# EAGLE design XBee-Regulated-v12 (EAGLE 5.04)
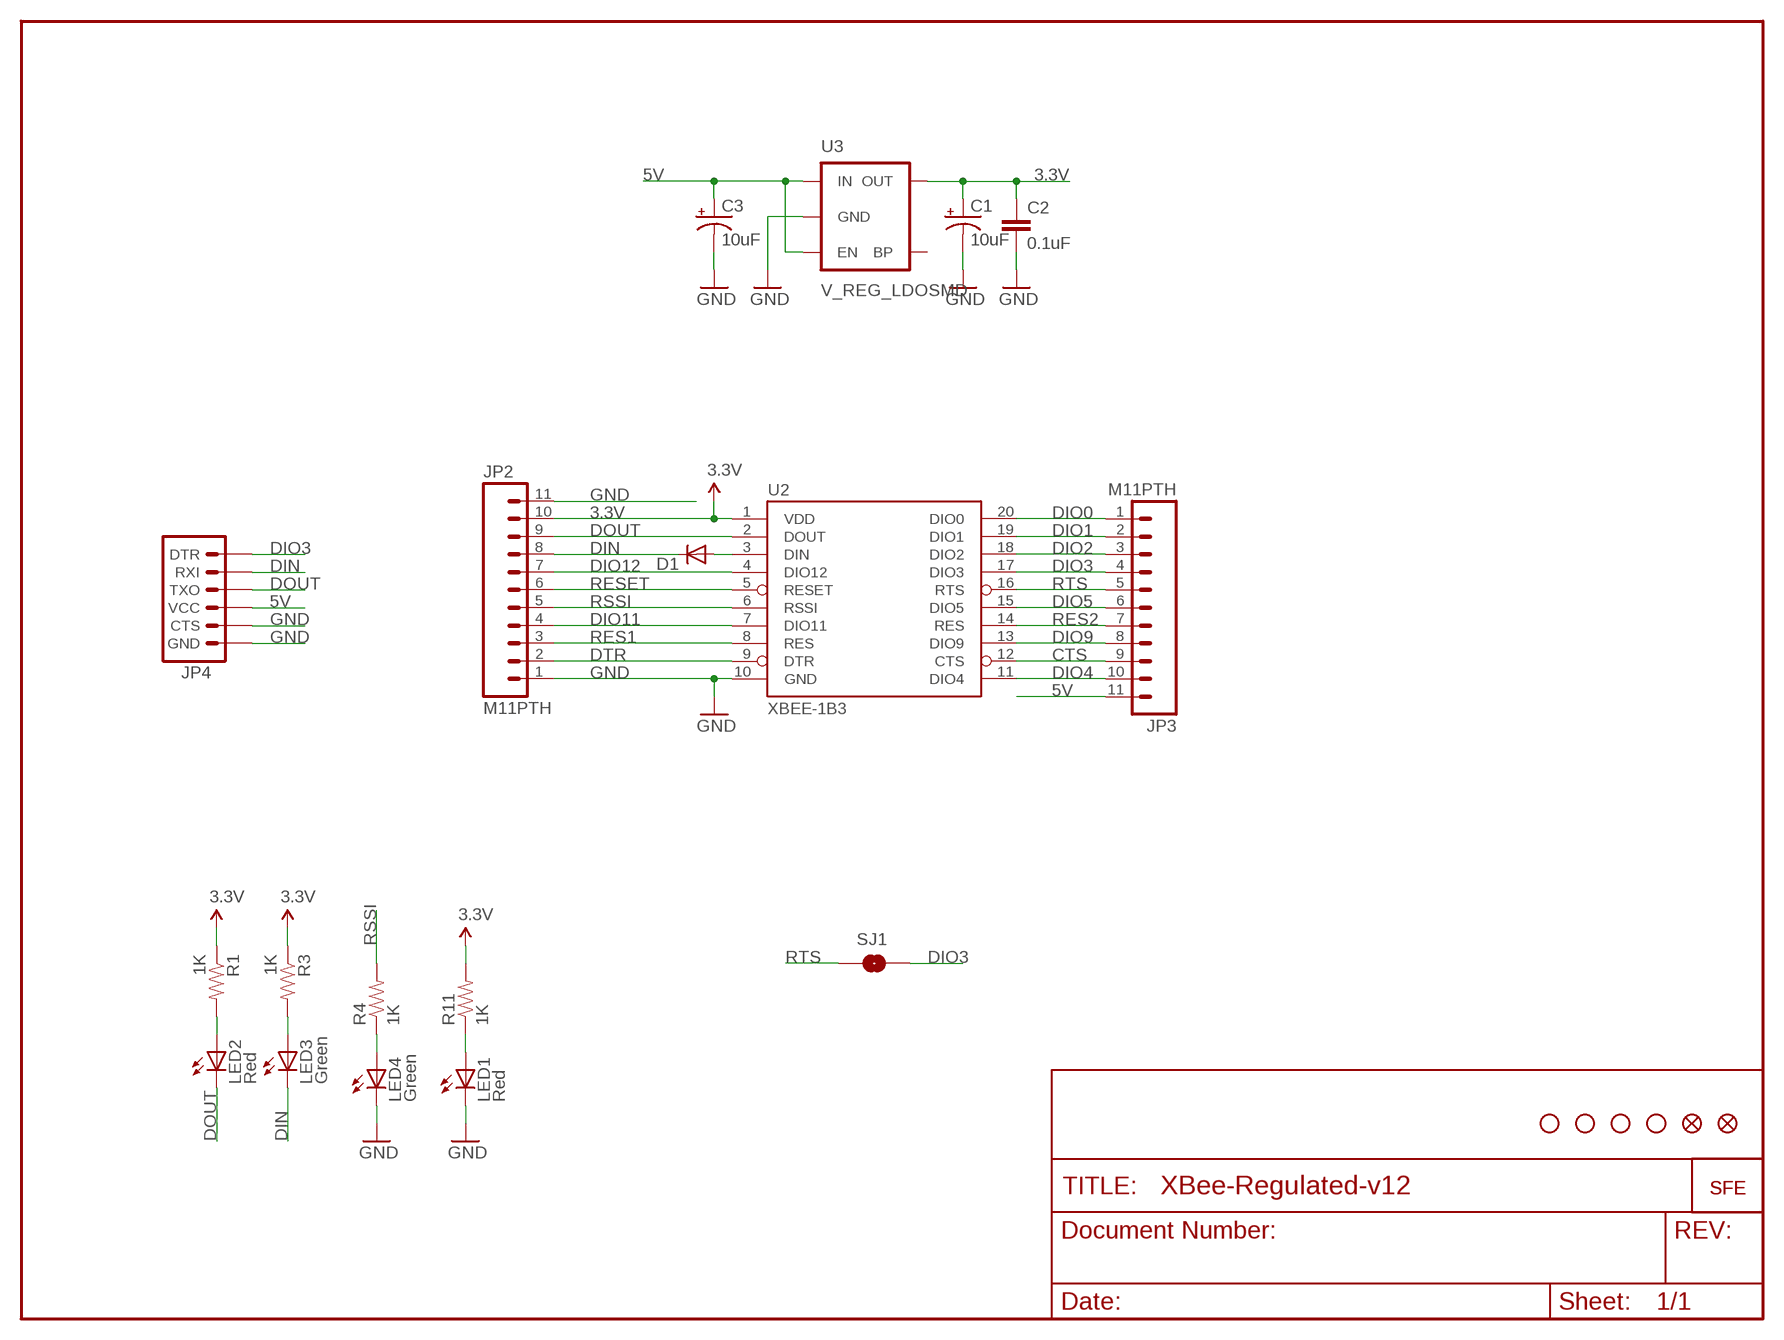
[diagram p0: schematic, sheet 1]

## Parts
C1  10uF  CAP_POL1206  [EIA3216]
C2  0.1uF  CAP0402-CAP  [0402-CAP]
C3  10uF  CAP_POL1206  [EIA3216]
D1  DIODESOD  [SOD-323]
JP2  M11PTH  [1X11]
JP3  M11PTH  [1X11]
JP4  ARDUINO_SERIAL_PROGRAMPTH  [1X06]
LED1  Red  LED0603  [LED-0603]
LED2  Red  LED0603  [LED-0603]
LED3  Green  LED0603  [LED-0603]
LED4  Green  LED0603  [LED-0603]
R1  1K  RESISTOR0402-RES  [0402-RES]
R3  1K  RESISTOR0402-RES  [0402-RES]
R4  1K  RESISTOR0402-RES  [0402-RES]
R11  1K  RESISTOR0402-RES  [0402-RES]
SJ1  SOLDERJUMPERNO  [SJ_2S-NO]
U2  XBEE-1B3  [XBEE-SMD]
U3  V_REG_LDOSMD  [SOT23-5]
U$1  LOGO-SFESK  [SFE-LOGO-FLAME]
U$4  LOGO-SFENEW  [SFE-NEW-WEBLOGO]
U$5  STAND-OFF  [STAND-OFF]
U$7  FIDUCIAL1X2  [FIDUCIAL-1X2]
U$9  STAND-OFF  [STAND-OFF]
U$10  STAND-OFF  [STAND-OFF]
U$11  STAND-OFF  [STAND-OFF]
U$16  FIDUCIAL1X2  [FIDUCIAL-1X2]

## Nets
3.3V [vcc]: C1.A(+) C2.1 JP2.10 R1.1 R3.1 R11.2 U2.1(VDD) U3.5(OUT)
5V [vcc]: C3.A(+) JP3.11 JP4.4(VCC) U3.1(IN) U3.3(EN)
CTS: JP3.9 U2.12(CTS)
DIN: D1.1(C) JP2.8 JP4.2(RXI) LED3.C
DIO0: JP3.1 U2.20(DIO0)
DIO1: JP3.2 U2.19(DIO1)
DIO2: JP3.3 U2.18(DIO2)
DIO3: JP3.4 JP4.1(DTR) SJ1.2 U2.17(DIO3)
DIO4: JP3.10 U2.11(DIO4)
DIO5: JP3.6 U2.15(DIO5)
DIO9: JP3.8 U2.13(DIO9)
DIO11: JP2.4 U2.7(DIO11)
DIO12: JP2.7 U2.4(DIO12)
DOUT: JP2.9 JP4.3(TXO) LED2.C U2.2(DOUT)
DTR: JP2.2 U2.9(DTR)
GND [vcc]: C1.C(-) C2.2 C3.C(-) JP2.1 JP2.11 JP4.5(CTS) JP4.6(GND) LED1.C LED4.C U2.10(GND) U3.2(GND)
N$1: LED2.A R1.2
N$2: LED4.A R4.1
N$3: D1.2(A) U2.3(DIN)
N$4: LED3.A R3.2
N$38: LED1.A R11.1
RES1: JP2.3 U2.8(RES)
RES2: JP3.7 U2.14(RES)
RESET: JP2.6 U2.5(RESET)
RSSI: JP2.5 R4.2 U2.6(RSSI)
RTS: JP3.5 SJ1.1 U2.16(RTS)
Unconnected: U3.4(BP)

## Library data of the parts
C1 C3 = SparkFun:CAP_POL: Capacitor Polarized These are standard SMD and PTH capacitors. Normally 10uF, 47uF, and 100uF in electrolytic and tantalum varieties. Always verify the external diameter of the through hole cap, it varies with capacity, voltage, and manufacturer. The EIA devices should be standard.
C2 = SparkFun:CAP: Capacitor Standard 0603 ceramic capacitor, and 0.1" leaded capacitor.
D1 = SparkFun:DIODE: Diode These are standard reverse protection diodes and small signal diodes. SMA package can handle up to about 1A. SOD-323 can handle about 200mA. What the SOD-323 package when ordering, there are some mfgs out there that are 5-pin packages.
JP2 JP3 = SparkFun:M11: Header 11 Standard 11-pin 0.1" header. Use with straight break away headers (SKU : PRT-00116), right angle break away headers (PRT-00553), swiss pins (PRT-00743), machine pins (PRT-00117), and female headers (PRT-00115).
JP4 = SparkFun:ARDUINO_SERIAL_PROGRAM
LED1-LED4 = SparkFun:LED: LEDs Standard schematic elements and footprints for 5mm, 3mm, 1206, and 0603 sized LEDs. 5mm - Spark Fun Electronics SKU : COM-00529 (and others)
R1 R3 R4 R11 = SparkFun:RESISTOR: Resistor Basic schematic elements and footprints for 0603, 1206, and PTH 1/10th watt (small) resistors.
SJ1 = SparkFun:SOLDERJUMPER: Solder Jumper Standard SMD solder jumper. Used to automate production. Two varients : Normally Open and Normally Closed are the same, but have different paste layers. NC will have a large amount of paste and should jumper during reflow.
U2 = SparkFun:XBEE-1
U3 = SparkFun:V_REG_LDO: Voltage Regulator LDO Standard 150mA LDO voltage regulator in SOT-23 layout. Micrel part MIC5205. BP (by-pass) pin is used to lower output noise with 470pF cap.
U$1 U$4 = SparkFun:LOGO-SFE: Spark Fun Electronics PCB Logo This is the standard Spark Fun Electronics PCB logo.
U$5 U$9-U$11 = SparkFun:STAND-OFF: Stand Off This is the mechanical footprint for a #4 phillips button head screw. Use the keepout ring to avoid running the screw head into surrounding components. SKU : PRT-00447
U$7 U$16 = SparkFun:FIDUCIAL: Fiducial Alignment Points Various fiducial points for machine vision alignment.

## Net classes
0 default: width 0.203 mm
1 vcc: width 0.305 mm
2 gnd: width 0.254 mm

## Board
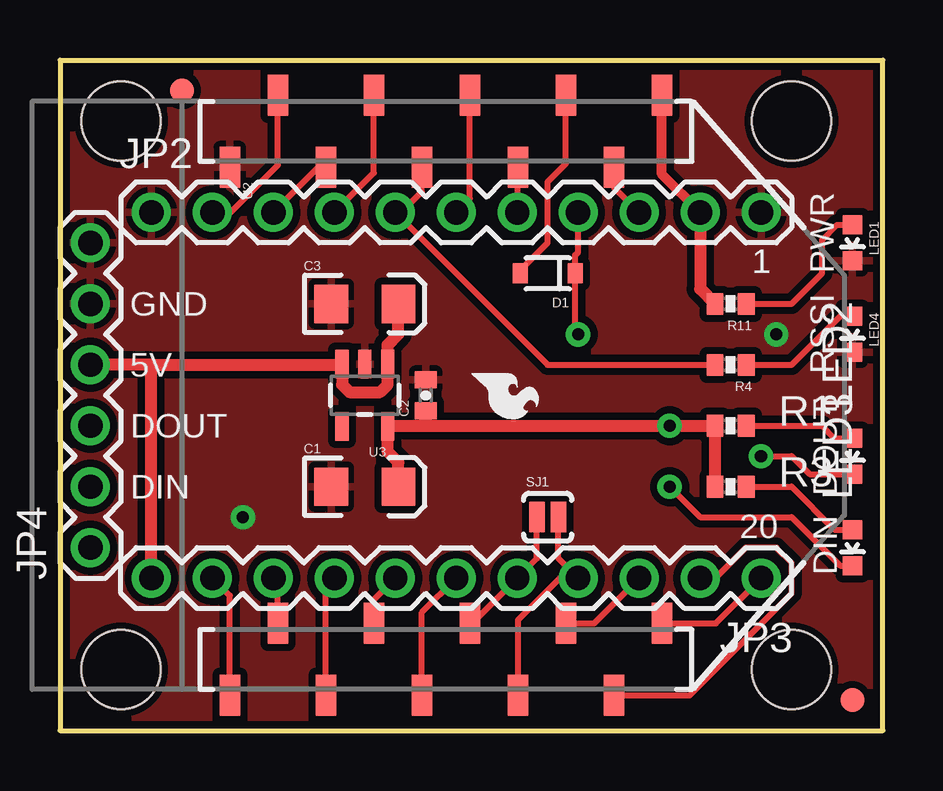
[diagram p1: board, top side]
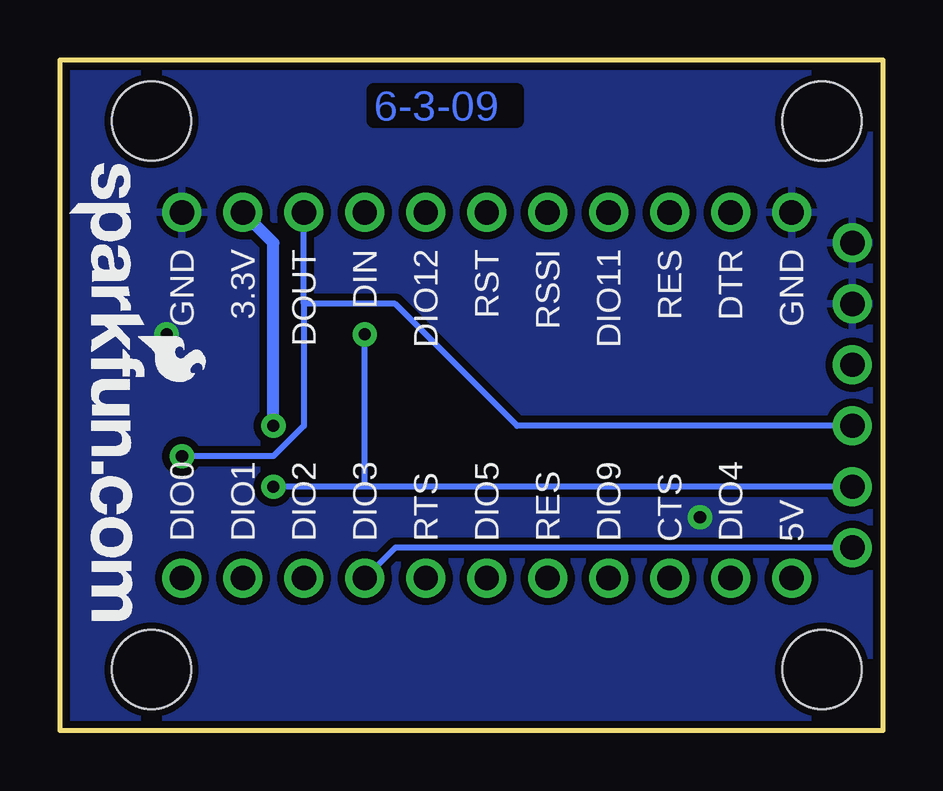
[diagram p2: board, bottom side, seen from below]

Size 34.29 x 27.94 mm. Coordinates in mm from the lower left corner, seen from the top.
Outline: 34.29,0 34.29,27.94 0,27.94 0,0 34.29,0
Copper layers (1*16): Top 0.035mm / dielectric 1.5mm / Bottom 0.035mm
Design rules "SparkFun": minimum track width 8mil, minimum drill 20mil, track to track 8mil, track to pad 8mil, pad to pad 8mil, via to via 8mil, smd to smd 8mil, copper to edge 10mil, drill to drill 8mil, minimum pad ring 12mil, minimum via ring 10mil, stop-mask expansion 4mil, vias tented up to drill 20mil, thermal gap 10mil

### Footprints (pad centres in the part's own frame; a part is rotated, then mirrored left to right if it is on the bottom)
EIA3216 = smd 1.4 x 1.6: A 1.4,0; C -1.4,0
0402-CAP = smd 0.7 x 0.9: 1 -0.65,0; 2 0.65,0
SOD-323 = smd 0.63 x 0.83: 1 -1.15,0; 2 1.15,0
1X11 = drill 1.016 round: 1 0,0; 2 2.54,0; 3 5.08,0; 4 7.62,0; 5 10.16,0; 6 12.7,0; 7 15.24,0; 8 17.78,0; 9 20.32,0; 10 22.86,0; 11 25.4,0
1X06 = drill 1.016 round: 1 0,0; 2 2.54,0; 3 5.08,0; 4 7.62,0; 5 10.16,0; 6 12.7,0
LED-0603 = smd 0.8 x 0.8: A 0,-0.75; C 0,0.75
0402-RES = smd 0.7 x 0.9: 1 -0.65,0; 2 0.65,0
SJ_2S-NO = smd 0.635 x 1.27: 1 -0.45,0; 2 0.45,0
XBEE-SMD = smd 1.7 x 0.85: 1 -12.5,20; 2 -9.5,18; 3 -12.5,16; 4 -9.5,14; 5 -12.5,12; 6 -9.5,10; 7 -12.5,8; 8 -9.5,6; 9 -12.5,4; 10 -9.5,2; 11 12.5,2; 12 9.5,4; 13 12.5,6; 14 9.5,8; 15 12.5,10; 16 9.5,12; 17 12.5,14; 18 9.5,16; 19 12.5,18; 20 9.5,20
SOT23-5 = smd 0.55 x 1.2: 1 -0.95,-1.3; 2 0,-1.3; 3 0.95,-1.3; 4 0.95,1.3; 5 -0.95,1.3
STAND-OFF = hole 3.302: 0,0
FIDUCIAL-1X2 = smd 1 x 1: 1 0,0

### Placement (x,y rotation side)
C1  12.7,10.16 0 top
C2  15.24,13.97 90 top
C3  12.7,17.78 0 top
D1  20.32,19.05 180 top
JP2  3.81,21.59 0 top
JP3  29.21,6.35 180 top
JP4  1.27,7.62 90 top
LED1  33.02,20.32 180 top
LED2  33.02,11.43 180 top
LED3  33.02,7.62 180 top
LED4  33.02,16.51 180 top
R1  27.94,12.7 0 top
R3  27.94,10.16 0 top
R4  27.94,15.24 180 top
R11  27.94,17.78 180 top
SJ1  20.32,8.89 0 top
U2  5.08,13.97 270 top
U3  12.7,13.97 180 top
U$1  17.14,14.86 270 top
U$4  33.91,23.62 270 bottom
U$5  2.54,2.54 0 top
U$7  33.02,1.27 0 top
U$9  2.54,25.4 0 top
U$10  30.48,25.4 0 top
U$11  30.48,2.54 0 top
U$16  5.08,26.67 0 top

### Tracks (layer width: path | path; a pad name or v marks a point on that pad's centre or on a via)
3.3V  (via drill 0.51)
  Top 0.406: U2.1 25.08,23.18 JP2.10
  Top 0.508: 15.24,12.7 v25.4,12.7 R1.1 27.29,10.18 27.3,10.16 R3.1 | 15.24,12.7 C2.1 | U3.5 13.69,12.67 13.72,12.7 15.24,12.7 | U3.5 13.87,12.67 | C1.A 14.1,11.17 13.84,11.43 | 13.84,11.43 13.72,11.56 | U3.5 13.65,11.62 13.84,11.43 | R11.2 26.67,18.4 JP2.10
  Bottom 0.508: JP2.10 25.4,20.32 v25.4,12.7
5V
  Top 0.508: 3.81,15.24 JP4.4 | 3.81,15.24 11.68,15.24 11.71,15.27 U3.3 11.75,14.41 12.06,14.1 13.34,14.1 13.65,14.41 U3.1 13.65,16.06 14.1,16.51 C3.A | JP3.11 3.81,15.24
CTS
  Top 0.254: U2.12 9.08,6.16 JP3.9
DIN  (via drill 0.51)
  Top 0.254: JP2.8 21.59,19.94 21.46,19.81 D1.1 21.47,16.63 v21.59,16.51 | LED3.C 32.5,6.87 30.48,8.89 26.67,8.89 v25.4,10.16
  Bottom 0.254: JP4.2 21.59,10.16 | 21.59,10.16 v25.4,10.16 | 21.59,10.16 v21.59,16.51
DIO0
  Top 0.254: U2.20 27.33,4.47 JP3.1
DIO1
  Top 0.254: U2.19 26.23,1.47 30.48,5.71 30.48,6.99 29.84,7.62 28.57,7.62 27.3,6.35 JP3.2
DIO2
  Top 0.254: U2.18 22.25,4.47 JP3.3
DIO3
  Top 0.254: U2.17 19.08,4.6 20.83,6.35 JP3.4 20.77,7.17 SJ1.2
  Bottom 0.254: JP4.1 20.32,7.62 JP3.4
DIO4
  Top 0.254: U2.11 7.08,5.62 JP3.10
DIO5
  Top 0.254: U2.15 15.08,4.92 JP3.6
DIO9
  Top 0.254: U2.13 11.08,6 JP3.8
DIO11
  Top 0.254: U2.7 13.08,23.24 JP2.4
DIO12
  Top 0.254: U2.4 19.08,21.62 JP2.7
DOUT  (via drill 0.51)
  Top 0.254: U2.2 23.08,22.64 JP2.9 | LED2.C 31.23,10.68 30.48,11.43 v29.21,11.43
  Bottom 0.254: JP4.3 15.24,12.7 20.32,17.78 24.13,17.78 | 24.13,17.78 JP2.9 | v29.21,11.43 25.4,11.43 24.13,12.7 24.13,17.78
DTR
  Top 0.254: JP2.2 7.11,21.59 9.08,23.56 U2.9
GND  (via drill 0.51)
  other vias: 7.62,8.89 29.84,16.51
  pour Bottom (isolate 0.305): 0,27.94 34.29,27.94 34.29,0 0,0
  pour Top (isolate 0.305): 0,27.94 34.29,27.94 34.29,0 0,0
N$1
  Top 0.254: R1.2 31.75,12.7 32.27,12.18 LED2.A
N$2
  Top 0.254: R4.1 30.48,15.24 32.5,17.26 LED4.A
N$3
  Top 0.254: U2.3 21.08,23.62 20.32,22.86 20.32,20.32 19.05,19.05 D1.2
N$4
  Top 0.254: R3.2 30.48,10.16 32.27,8.37 LED3.A
N$38
  Top 0.254: R11.1 30.48,17.78 31.75,19.05 31.75,20.45 32.37,21.07 LED1.A
RES1
  Top 0.254: U2.8 10.77,23.47 JP2.3
RES2
  Top 0.254: U2.14 13.08,5.46 JP3.7
RESET
  Top 0.254: U2.5 17.08,22.16 JP2.6
RSSI
  Top 0.254: U2.6 15.08,22.45 14.22,21.59 JP2.5 20.32,15.24 R4.2
RTS
  Top 0.254: U2.16 17.17,4.47 JP3.5 19.87,7.17 SJ1.1

### Text on the board
Bottom: 6-3-09
tPlace: 1 | PWR | GND | 5V | RSSI | DOUT | DIN | DOUT | 20 | DIN
bPlace: GND | DTR | RES | DIO11 | RSSI | RST | DIO12 | DIN | DOUT | 3.3V | GND | 5V | DIO4 | CTS | DIO9 | RES | DIO5 | RTS | DIO3 | DIO2 | DIO1 | DIO0
tValues: XBee Socket Up | DNP | DNP | XBee Socket Up